# EAGLE design nfr24l_module (EAGLE 6.5.0)
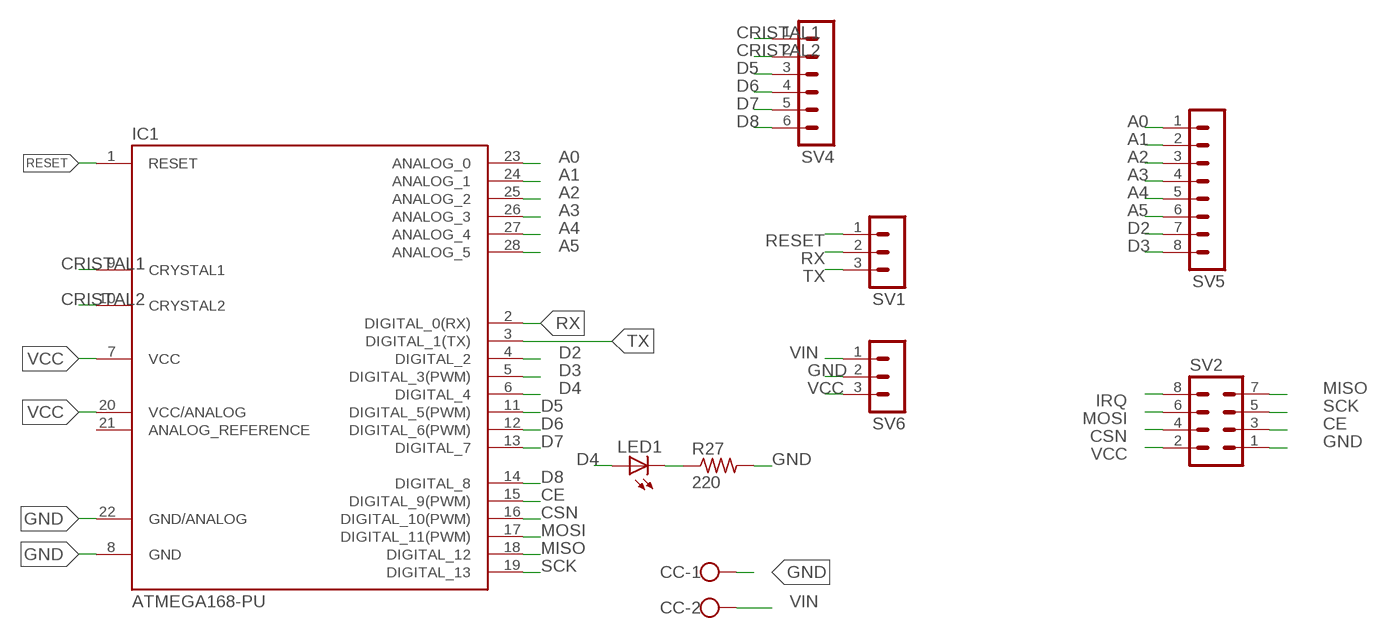
[diagram p0: schematic, sheet 1]

## Parts
CC  W237-102  [W237-102]
IC1  ATMEGA168-PU  [DIL28-3]
LED1  LED3MM  [LED3MM]
R27  220  R-US_0207/7  [0207/7]
SV1  MA03-1  [MA03-1]
SV2  MA04-2  [MA04-2]
SV4  MA06-1  [MA06-1]
SV5  MA08-1  [MA08-1]
SV6  MA03-1  [MA03-1]

## Nets
A0: IC1.23(ANALOG_0) SV5.1
A1: IC1.24(ANALOG_1) SV5.2
A2: IC1.25(ANALOG_2) SV5.3
A3: IC1.26(ANALOG_3) SV5.4
A4: IC1.27(ANALOG_4) SV5.5
A5: IC1.28(ANALOG_5) SV5.6
CE: IC1.15(DIGITAL_9(PWM)) SV2.3
CRISTAL1: IC1.9(CRYSTAL1) SV4.1
CRISTAL2: IC1.10(CRYSTAL2) SV4.2
CSN: IC1.16(DIGITAL_10(PWM)) SV2.4
D2: IC1.4(DIGITAL_2) SV5.7
D3: IC1.5(DIGITAL_3(PWM)) SV5.8
D4: IC1.6(DIGITAL_4) LED1.A
D5: IC1.11(DIGITAL_5(PWM)) SV4.3
D6: IC1.12(DIGITAL_6(PWM)) SV4.4
D7: IC1.13(DIGITAL_7) SV4.5
D8: IC1.14(DIGITAL_8) SV4.6
GND: CC.1 IC1.8(GND) IC1.22(GND/ANALOG) R27.2 SV2.1 SV6.2
IRQ: SV2.8
MISO: IC1.18(DIGITAL_12) SV2.7
MOSI: IC1.17(DIGITAL_11(PWM)) SV2.6
N$7: LED1.K(C) R27.1
RESET: IC1.1(RESET) SV1.1
RX: IC1.2(DIGITAL_0(RX)) SV1.2
SCK: IC1.19(DIGITAL_13) SV2.5
TX: IC1.3(DIGITAL_1(TX)) SV1.3
VCC: IC1.7(VCC) IC1.20(VCC/ANALOG) SV2.2 SV6.3
VIN: CC.2 SV6.1
Unconnected: IC1.21(ANALOG_REFERENCE)

## Library data of the parts
CC = con-wago-500:W237-102: WAGO SCREW CLAMP; MPN: 237-102; OC_FARNELL: unknown; OC_NEWARK: 70K9898
IC1 = Arduino-AVR:ATMEGA168-PU
LED1 = led:LED: LED OSRAM: - CHIPLED LG R971, LG N971, LY N971, LG Q971, LY Q971, LO R971, LY R971 LH N974, LH R974 LS Q976, LO Q976, LY Q976 LO Q996 - Hyper CHIPLED LW Q18S LB Q993, LB Q99A, LB R99A - SideLED LS A670, LO A670, LY A670, LG A670, LP A670 LB A673, LV A673, LT A673, LW A673 LH A674 LY A675 LS A676, LA A676, LO A676, LY A676, LW A676 LS A679, LY A679, LG A679 - Hyper Micro SIDELED® LS Y876, LA Y876, LO Y876, LY Y876 LT Y87S - SmartLED LW L88C, LW L88S LB L89C, LB L89S, LG L890 LS L89K, LO L89K, LY L89K LS L896, LA L896, LO L896, LY L896 - TOPLED LS T670, LO T670, LY T670, LG T670, LP T670 LSG T670, LSP T670, LSY T670, LOP T670, LYG T670 LG T671, LOG T671, LSG T671 LB T673, LV T673, LT T673, LW T673 LH T674 LS T676, LA T676, LO T676, LY T676, LB T676, LH T676, LSB T676, LW T676 LB T67C, LV T67C, LT T67C, LS T67K, LO T67K, LY T67K, LW E67C LS E67B, LA E67B, LO E67B, LY E67B, LB E67C, LV E67C, LT E67C LW T67C LS T679, LY T679, LG T679 LS T770, LO T770, LY T770, LG T770, LP T770 LB T773, LV T773, LT T773, LW T773 LH T774 LS E675, LA E675, LY E675, LS T675 LS T776, LA T776, LO T776, LY T776, LB T776 LHGB T686 LT T68C, LB T68C - Hyper Mini TOPLED® LB M676 - Mini TOPLED Santana® LG M470 LS M47K, LO M47K, LY M47K Source: http://www.osram.convergy.de LUXEON: - LUMILED® LXK2-PW12-R00, LXK2-PW12-S00, LXK2-PW14-U00, LXK2-PW14-V00 LXK2-PM12-R00, LXK2-PM12-S00, LXK2-PM14-U00 LXK2-PE12-Q00, LXK2-PE12-R00, LXK2-PE12-S00, LXK2-PE14-T00, LXK2-PE14-U00 LXK2-PB12-K00, LXK2-PB12-L00, LXK2-PB12-M00, LXK2-PB14-N00, LXK2-PB14-P00, LXK2-PB14-Q00 LXK2-PR12-L00, LXK2-PR12-M00, LXK2-PR14-Q00, LXK2-PR14-R00 LXK2-PD12-Q00, LXK2-PD12-R00, LXK2-PD12-S00 LXK2-PH12-R00, LXK2-PH12-S00 LXK2-PL12-P00, LXK2-PL12-Q00, LXK2-PL12-R00 Source: www.luxeon.com KINGBRIGHT: KA-3528ASYC Source: www.kingbright.com
R27 = rcl:R-US_: RESISTOR, American symbol
SV1 SV6 = con-lstb:MA03-1: PIN HEADER; OC_FARNELL: unknown; OC_NEWARK: unknown
SV2 = con-lstb:MA04-2: PIN HEADER; OC_FARNELL: unknown; OC_NEWARK: unknown
SV4 = con-lstb:MA06-1: PIN HEADER; OC_FARNELL: unknown; OC_NEWARK: unknown
SV5 = con-lstb:MA08-1: PIN HEADER; OC_FARNELL: unknown; OC_NEWARK: unknown

## Board
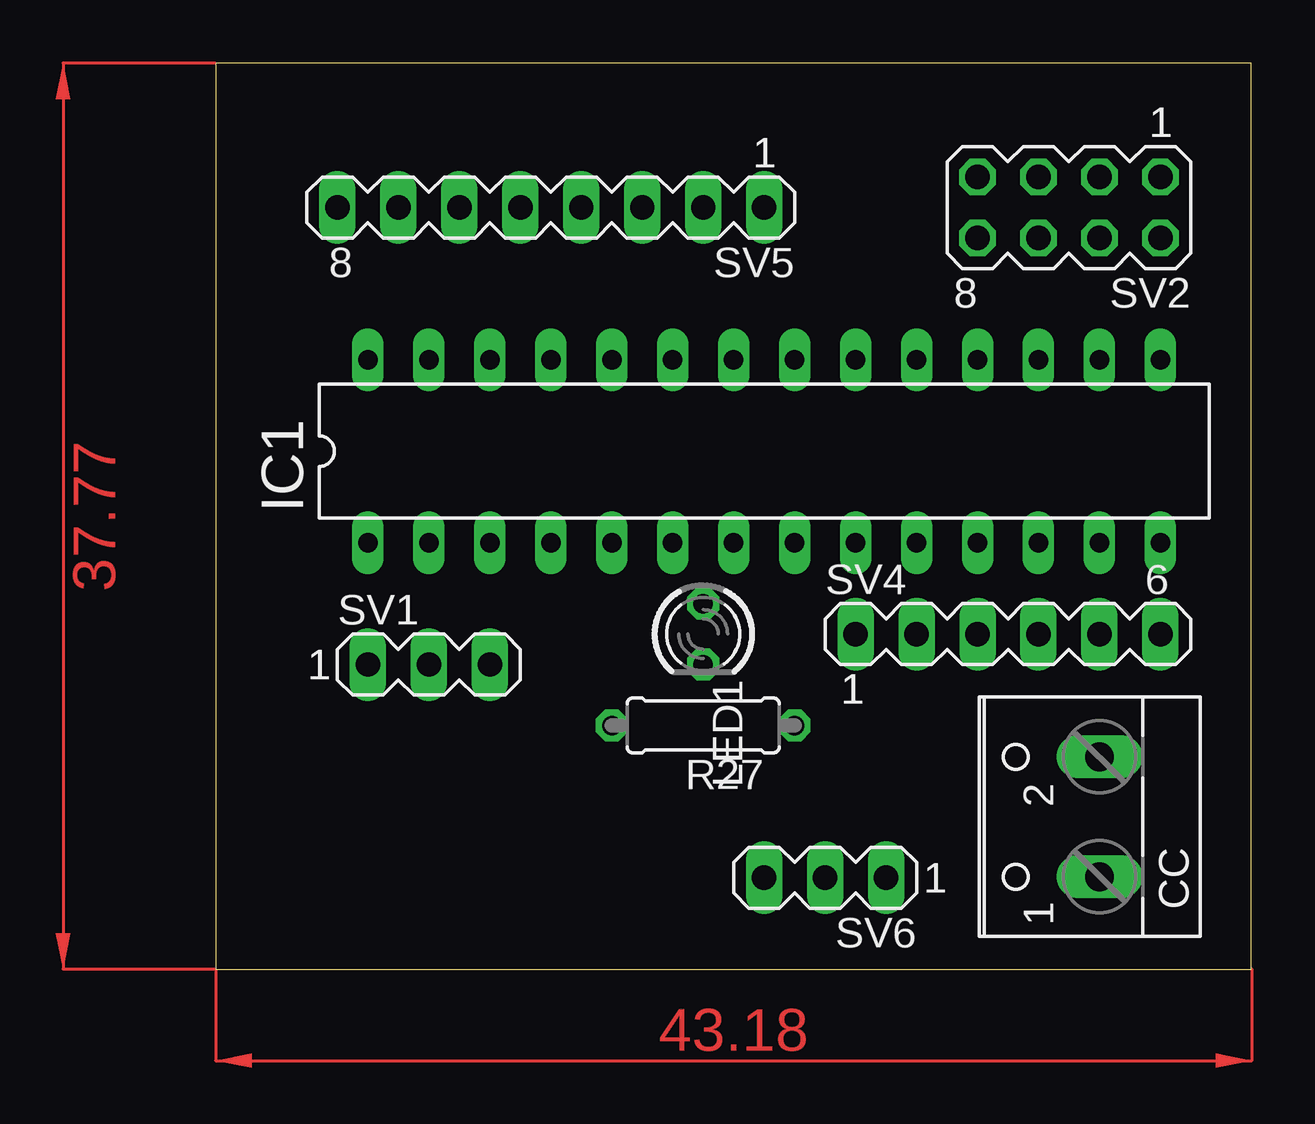
[diagram p1: board, top side]
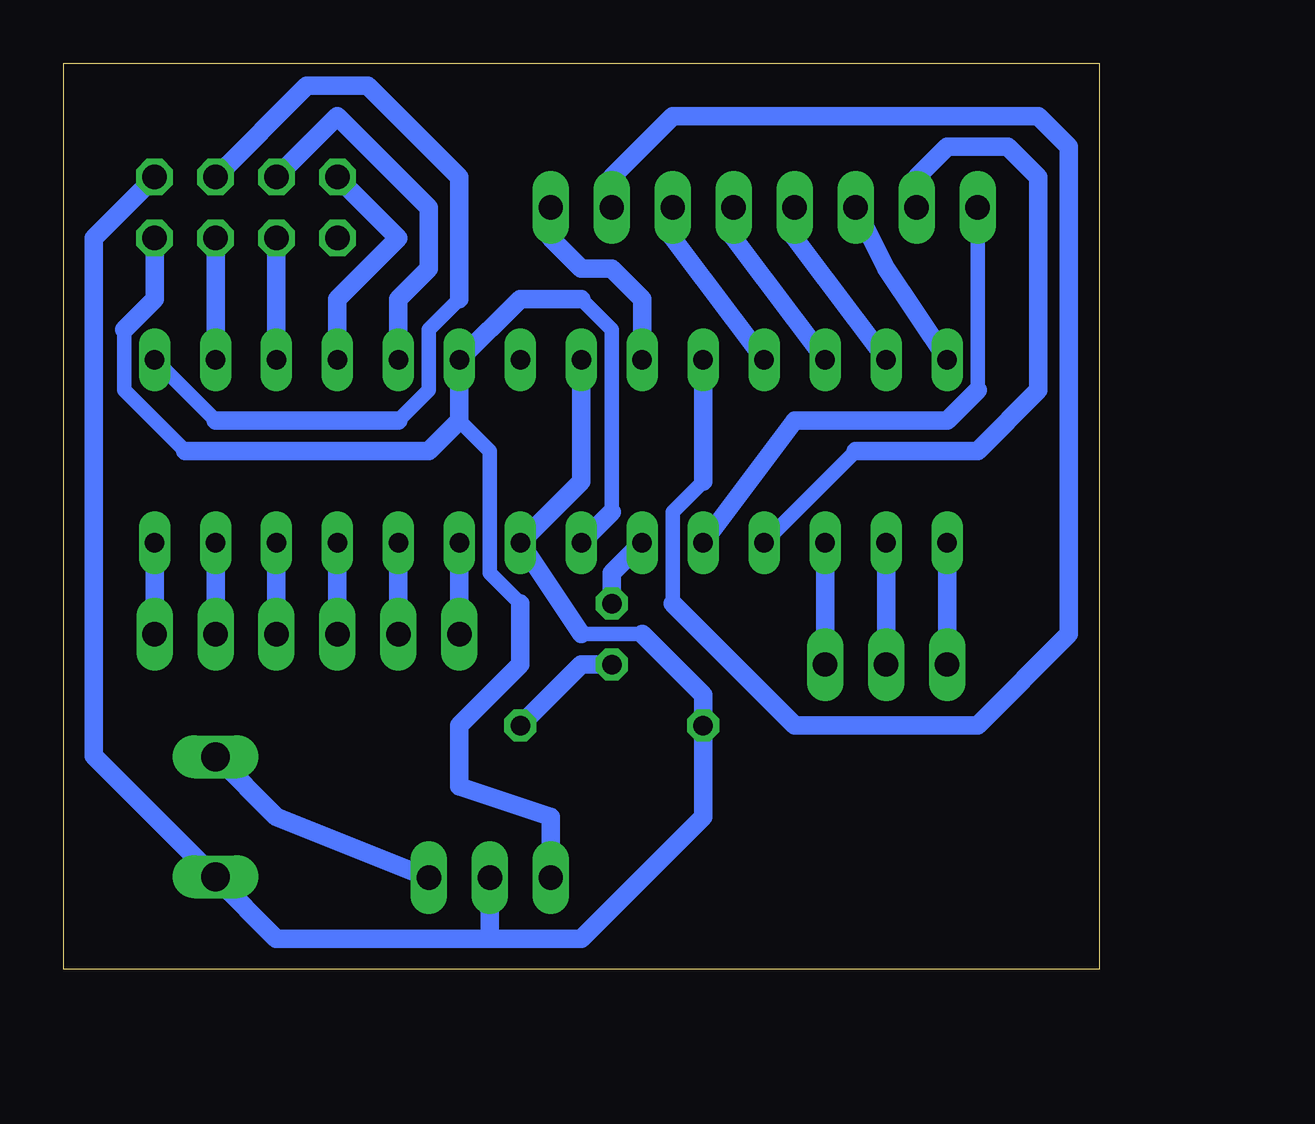
[diagram p2: board, bottom side, seen from below]

Size 43.16 x 37.77 mm. Coordinates in mm from the lower left corner, seen from the top.
Outline: 0,0 43.16,0 43.16,37.77 0,37.77 0,0
Copper layers (1*16): Top 0.035mm / dielectric 1.5mm / Bottom 0.035mm
Design rules "default *": minimum track width 30mil, minimum drill 24mil, track to track 8mil, track to pad 8mil, pad to pad 8mil, via to via 8mil, smd to smd 8mil, copper to edge 40mil, drill to drill 8mil, minimum pad ring 10mil, minimum via ring 8mil, stop-mask expansion 4mil, vias tented up to drill 0mil, thermal gap 10mil

### Footprints (pad centres in the part's own frame; a part is rotated, then mirrored left to right if it is on the bottom)
W237-102 = drill 1.194 long: 1 -2.5,-1.27; 2 2.5,-1.27
DIL28-3 = drill 0.813 long: 1 -16.51,-3.81; 2 -13.97,-3.81; 3 -11.43,-3.81; 4 -8.89,-3.81; 5 -6.35,-3.81; 6 -3.81,-3.81; 7 -1.27,-3.81; 8 1.27,-3.81; 9 3.81,-3.81; 10 6.35,-3.81; 11 8.89,-3.81; 12 11.43,-3.81; 13 13.97,-3.81; 14 16.51,-3.81; 15 16.51,3.81; 16 13.97,3.81; 17 11.43,3.81; 18 8.89,3.81; 19 6.35,3.81; 20 3.81,3.81; 21 1.27,3.81; 22 -1.27,3.81; 23 -3.81,3.81; 24 -6.35,3.81; 25 -8.89,3.81; 26 -11.43,3.81; 27 -13.97,3.81; 28 -16.51,3.81
LED3MM = drill 0.813 octagon: A -1.27,0; K 1.27,0
0207/7 = drill 0.813 octagon: 1 -3.81,0; 2 3.81,0
MA03-1 = drill 1.016 long: 1 -2.54,0; 2 0,0; 3 2.54,0
MA04-2 = drill 1.016 octagon: 1 -3.81,-1.27; 2 -3.81,1.27; 3 -1.27,-1.27; 4 -1.27,1.27; 5 1.27,-1.27; 6 1.27,1.27; 7 3.81,-1.27; 8 3.81,1.27
MA06-1 = drill 1.016 long: 1 -6.35,0; 2 -3.81,0; 3 -1.27,0; 4 1.27,0; 5 3.81,0; 6 6.35,0
MA08-1 = drill 1.016 long: 1 -8.89,0; 2 -6.35,0; 3 -3.81,0; 4 -1.27,0; 5 1.27,0; 6 3.81,0; 7 6.35,0; 8 8.89,0

### Placement (x,y rotation side)
CC  35.56,6.35 90 top
IC1  22.86,21.59 0 top
LED1  20.32,13.97 270 top
R27  20.32,10.16 180 top
SV1  8.89,12.7 0 top
SV2  35.56,31.75 180 top
SV4  33.02,13.97 0 top
SV5  13.97,31.75 180 top
SV6  25.4,3.81 180 top

### Tracks (layer width: path | path; a pad name or v marks a point on that pad's centre or on a via)
A0
  Bottom 0.762: IC1.23 19.05,27.94 20.32,29.21 21.59,29.21 22.86,30.48 SV5.1
A1
  Bottom 0.61: 16.51,20.32 17.78,19.05 17.78,15.24
  Bottom 0.762: 16.51,20.32 IC1.24 | 17.78,15.24 12.7,10.16 5.08,10.16 1.27,13.97 1.27,34.29 2.54,35.56 17.78,35.56 20.32,33.02 SV5.2
A2
  Bottom 0.762: IC1.25 17.78,30.48 SV5.3
A3
  Bottom 0.762: IC1.26 15.24,30.48 SV5.4
A4
  Bottom 0.762: IC1.27 12.7,30.48 SV5.5
A5
  Bottom 0.762: IC1.28 8.89,29.21 SV5.6
CE
  Bottom 0.61: 36.83,22.86 IC1.15 | 29.21,22.86 27.94,24.13 27.94,26.67 26.67,27.94
  Bottom 0.762: 29.21,22.86 36.83,22.86 | 26.67,27.94 26.67,33.02 30.48,36.83 33.02,36.83 SV2.3
CRISTAL1
  Bottom 0.762: SV4.1 IC1.9
CRISTAL2
  Bottom 0.762: SV4.2 IC1.10
CSN
  Bottom 0.762: SV2.4 IC1.16
D2
  Bottom 0.61: 10.16,21.59 IC1.4
  Bottom 0.762: 10.16,21.59 5.08,21.59 2.54,24.13 2.54,33.02 3.81,34.29 6.35,34.29 7.62,33.02 SV5.7
D3
  Bottom 0.61: SV5.8 5.08,24.13
  Bottom 0.762: IC1.5 12.7,22.86 6.35,22.86 5.08,24.13
D4
  Bottom 0.762: LED1.A 20.32,16.51 IC1.6
D5
  Bottom 0.762: SV4.3 IC1.11
D6
  Bottom 0.762: SV4.4 IC1.12
D7
  Bottom 0.762: SV4.5 IC1.13
D8
  Bottom 0.762: SV4.6 IC1.14
GND
  Bottom 0.61: 19.05,13.97 21.59,13.97
  Bottom 0.762: IC1.22 21.59,20.32 IC1.8 21.59,13.97 | 25.4,1.27 34.29,1.27 36.83,3.81 | 25.4,1.27 21.59,1.27 16.51,6.35 R27.2 16.51,11.43 19.05,13.97 | 25.4,1.27 SV6.2 | SV2.1 41.91,30.48 41.91,8.89 36.83,3.81 | 36.83,3.81 CC.1
MISO
  Bottom 0.762: IC1.18 31.75,27.94 29.21,30.48 SV2.7
MOSI
  Bottom 0.762: SV2.6 IC1.17
N$7
  Bottom 0.762: R27.1 21.59,12.7 LED1.K
RESET
  Bottom 0.762: SV1.1 IC1.1
RX
  Bottom 0.762: SV1.2 IC1.2
SCK
  Bottom 0.762: IC1.19 29.21,27.94 27.94,29.21 27.94,31.75 31.75,35.56 SV2.5
TX
  Bottom 0.762: SV1.3 IC1.3
VCC
  Bottom 0.61: 40.64,26.67 40.64,24.13 38.1,21.59 | 20.32,19.05 20.32,26.67 21.59,27.94 | 24.13,15.24 25.4,16.51 25.4,21.59 26.67,22.86
  Bottom 0.762: SV2.2 39.37,27.94 40.64,26.67 | 38.1,21.59 27.94,21.59 26.67,22.86 IC1.20 24.13,27.94 21.59,27.94 | 20.32,19.05 IC1.7 | SV6.3 22.86,6.35 26.67,7.62 26.67,10.16 24.13,12.7 24.13,15.24
VIN
  Bottom 0.762: SV6.1 34.29,6.35 36.83,8.89 CC.2
(copper drawn outside any net)
  shapes: Top area x2